# Altium schematic sheet 22-TimingConnections.SchDoc
size B; SheetNumber: 22; SheetTotal: 25; SPICEModelCacheZJVVAHZB: <root> / <DocumentId>ZJVVAHZB</DocumentId> / <CacheFrame Number="0"> / <Model Name="emk105bj105_v-f" Kind="CKT"> / <Text>* EMK105BJ105_V-F     SPICE MODEL  ( General Type ) / *-------------------------------------------------------------------------------------------------------- / * Model Generated by TAIYO YUDEN Corporation (http://www.ty-top.com) / * Version 1.0 / * TAIYO YUDEN Control No. 170508_130520 / * Copyright(c) 2012 TAIYO YUDEN CO.,LTD. All Rights Reserved. / *-------------------------------------------------------------------------------------------------------- / * / * Products Name : Multilayer Ceramic Capacitors / * / * Characteristics : / *     Capacitance : 1 uF , Rated Voltage : 16V , TCC : X5R / *     Case Size : 1.0 x 0.5 / 0.039 x 0.02 [mm/inch] , Thickness : 0.5 / 0.02 [mm/inch] / *     (Conditions: Temperature = 25 degC , DC Bias Current/Voltage = 0A / 0V) / * / * Frequency Range : 40Hz - 3GHz / * / * External Node Assignments : / * / *  1  o---| |---o  2 / * / *-------------------------------------------------------------------------------------------------------- / .SubCkt EMK105BJ105_V-F 1 2 / **************************** / C0 1 110 0.68309u / Cm 1 101 0.26053u / C1 101 102 0.94076u / Rc1 101 102 1.9029k / C2 102 103 0.66707u / Rc2 102 103 120.36 / C3 103 110 0.57203u / Rc3 103 110 2.1097 / C2m 1 301 0.1871u / C21 301 302 3.2494u / Rc21 301 302 1.1117k / C22 302 303 2.1014u / Rc22 302 303 1.484k / C23 303 304 2.1172u / Rc23 303 304 1.3876k / C24 304 305 0.75729u / Rc24 304 305 332.59 / C25 305 306 0.94401u / Rc25 305 306 249.09 / C26 306 307 0.34674u / Rc26 306 307 28.352 / C27 307 308 0.37158u / Rc27 307 308 19.989 / C28 308 309 0.17933u / Rc28 308 309 31.748 / C29 309 110 0.016445u / Rc29 309 110 1.0592 / Rp0 1 110 100Meg / L0 110 120 0.2216n / Lm 120 130 0.1509n / L1 120 121 0.12659n / RL1 121 130 0.85161 / L2 120 122 0.15996n / RL2 122 130 0.42469 / L3 120 123 7.9543n / RL3 123 130 0.54643m / CR 120 124 0.24334u / LR 124 125 0.090738n / RR 125 130 68.076m / CL 130 140 2.7354p / LL 130 140 0.10762n / RL 130 140 50.614 / Rs 140 2 7.5416m / **************************** / .ends EMK105BJ105_V-F</Text> / </Model> / </CacheFrame> / </root>
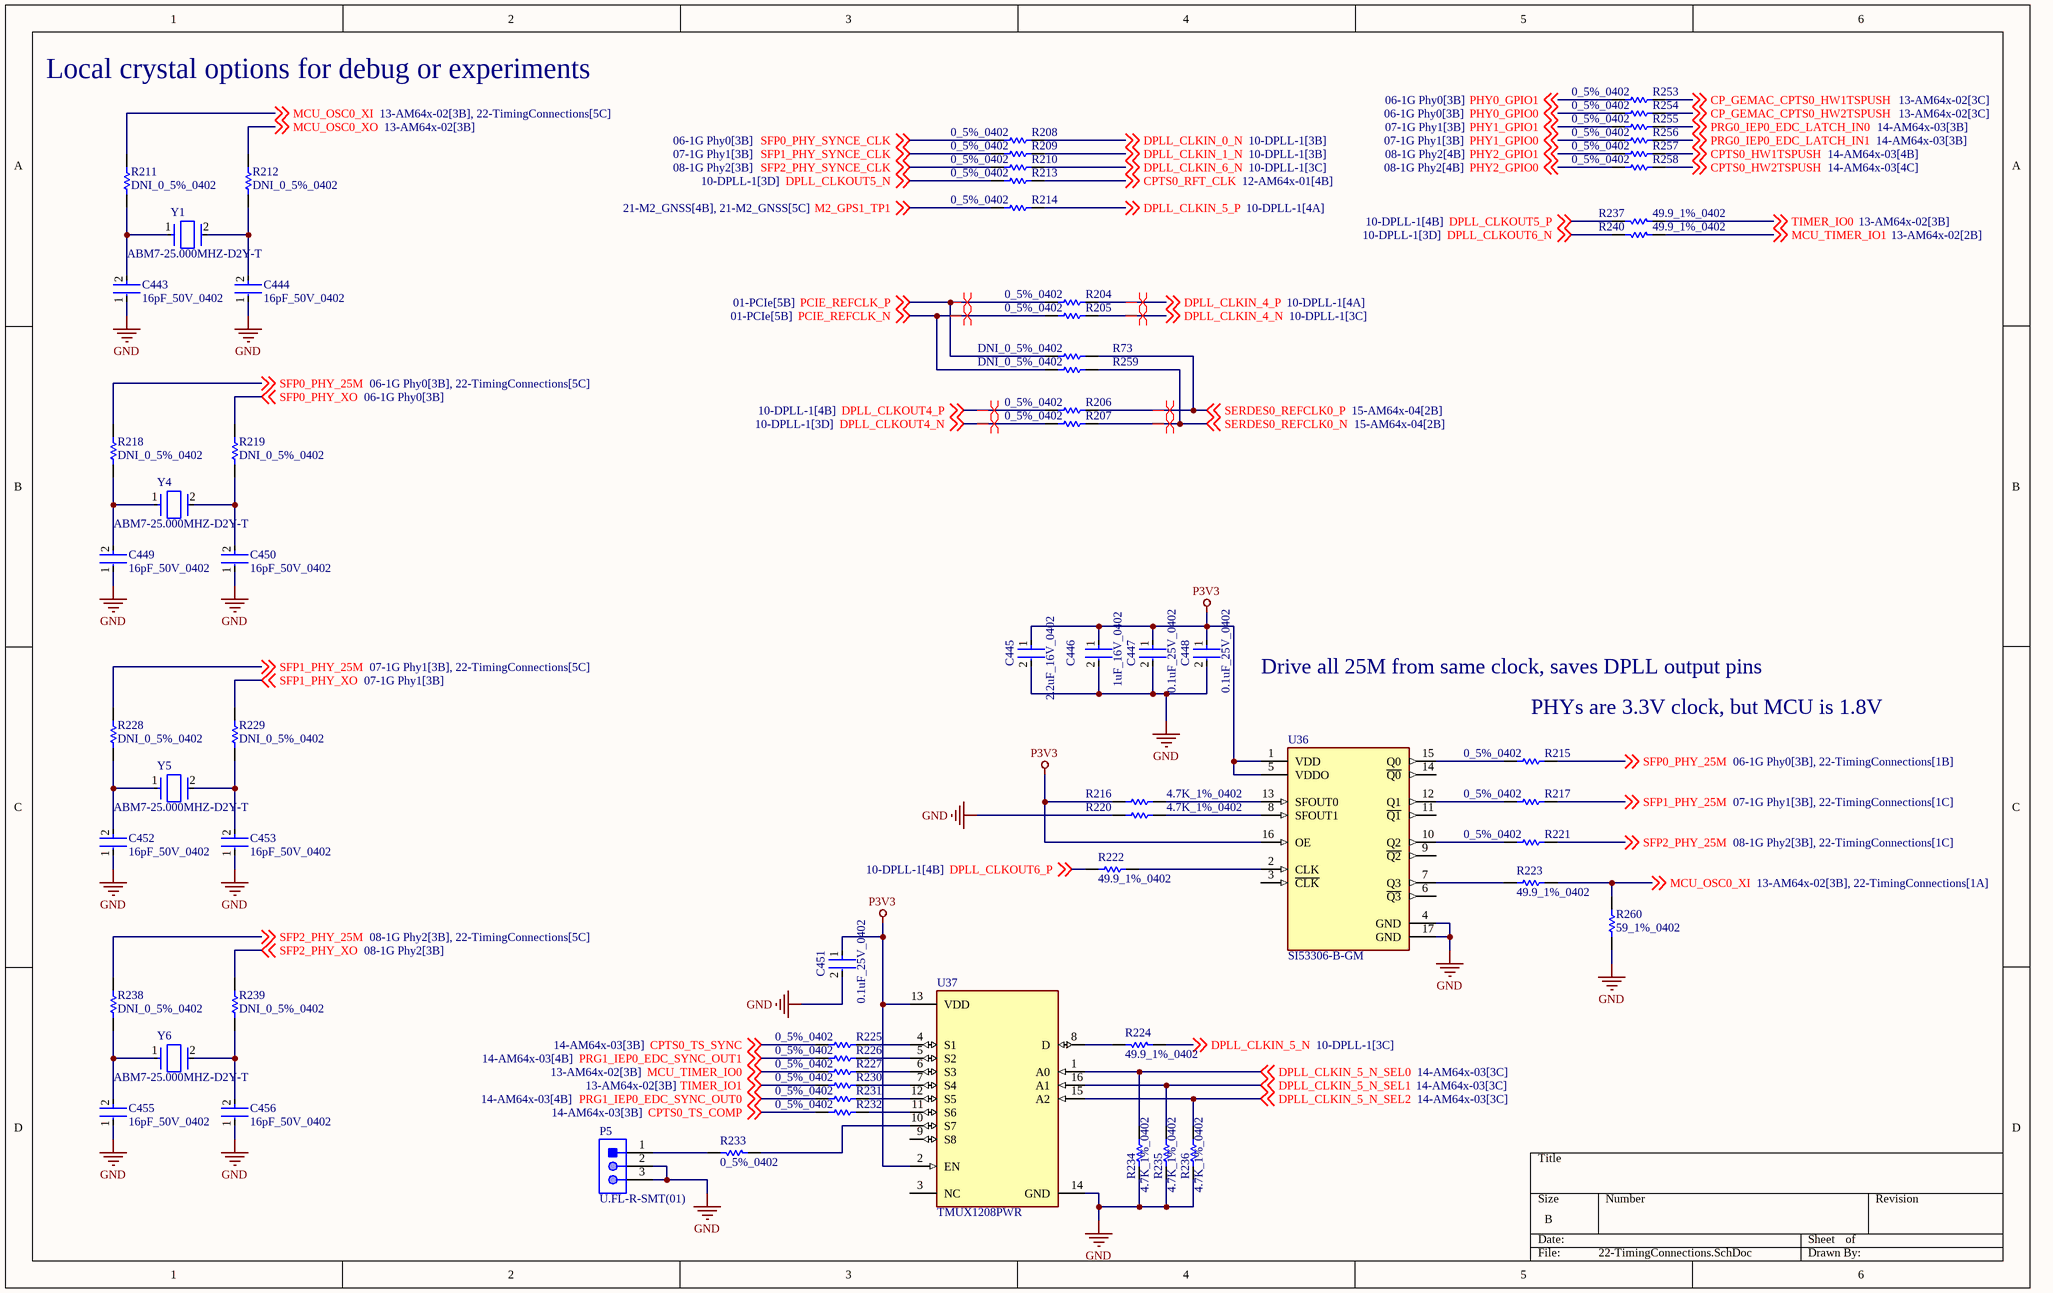
[diagram p0: 22-TimingConnections.SchDoc]

## Parts
C443  16pF_50V_0402  [FP-CBR04C-MFG]
C444  16pF_50V_0402  [FP-CBR04C-MFG]
C445  2.2uF_16V_0402  [FP-C1005-050-0_05-IPC_A]
C446  1uF_16V_0402  [FP-0402-L_1_0_0_05-W_0_5-IPC_A]
C447  0.1uF_25V_0402  [FP-0402-L_1_0_1-W_0_5_0_1-IPC_C]
C448  0.1uF_25V_0402  [FP-0402-L_1_0_1-W_0_5_0_1-IPC_C]
C449  16pF_50V_0402  [FP-CBR04C-MFG]
C450  16pF_50V_0402  [FP-CBR04C-MFG]
C451  0.1uF_25V_0402  [FP-0402-L_1_0_1-W_0_5_0_1-IPC_C]
C452  16pF_50V_0402  [FP-CBR04C-MFG]
C453  16pF_50V_0402  [FP-CBR04C-MFG]
C455  16pF_50V_0402  [FP-CBR04C-MFG]
C456  16pF_50V_0402  [FP-CBR04C-MFG]
P5  U.FL-R-SMT(01)  [HRS-U.FL-R-SMT(10)_V]
R73  DNI_0_5%_0402  [RESC1005X40X25LL10T10]  (no BOM)
R204  0_5%_0402  [RESC1005X40X25LL10T10]
R205  0_5%_0402  [RESC1005X40X25LL10T10]
R206  0_5%_0402  [RESC1005X40X25LL10T10]
R207  0_5%_0402  [RESC1005X40X25LL10T10]
R208  0_5%_0402  [RESC1005X40X25LL10T10]
R209  0_5%_0402  [RESC1005X40X25LL10T10]
R210  0_5%_0402  [RESC1005X40X25LL10T10]
R211  DNI_0_5%_0402  [RESC1005X40X25LL10T10]  (no BOM)
R212  DNI_0_5%_0402  [RESC1005X40X25LL10T10]  (no BOM)
R213  0_5%_0402  [RESC1005X40X25LL10T10]
R214  0_5%_0402  [RESC1005X40X25LL10T10]
R215  0_5%_0402  [RESC1005X40X25LL10T10]
R216  4.7K_1%_0402  [RESC1005X40X25NL10T10]
R217  0_5%_0402  [RESC1005X40X25LL10T10]
R218  DNI_0_5%_0402  [RESC1005X40X25LL10T10]  (no BOM)
R219  DNI_0_5%_0402  [RESC1005X40X25LL10T10]  (no BOM)
R220  4.7K_1%_0402  [RESC1005X40X25NL10T10]
R221  0_5%_0402  [RESC1005X40X25LL10T10]
R222  49.9_1%_0402  [RESC1005X40X25NL10T10]
R223  49.9_1%_0402  [RESC1005X40X25NL10T10]
R224  49.9_1%_0402  [RESC1005X40X25NL10T10]
R225  0_5%_0402  [RESC1005X40X25LL10T10]
R226  0_5%_0402  [RESC1005X40X25LL10T10]
R227  0_5%_0402  [RESC1005X40X25LL10T10]
R228  DNI_0_5%_0402  [RESC1005X40X25LL10T10]  (no BOM)
R229  DNI_0_5%_0402  [RESC1005X40X25LL10T10]  (no BOM)
R230  0_5%_0402  [RESC1005X40X25LL10T10]
R231  0_5%_0402  [RESC1005X40X25LL10T10]
R232  0_5%_0402  [RESC1005X40X25LL10T10]
R233  0_5%_0402  [RESC1005X40X25LL10T10]
R234  4.7K_1%_0402  [RESC1005X40X25NL10T10]
R235  4.7K_1%_0402  [RESC1005X40X25NL10T10]
R236  4.7K_1%_0402  [RESC1005X40X25NL10T10]
R237  49.9_1%_0402  [RESC1005X40X25NL10T10]
R238  DNI_0_5%_0402  [RESC1005X40X25LL10T10]  (no BOM)
R239  DNI_0_5%_0402  [RESC1005X40X25LL10T10]  (no BOM)
R240  49.9_1%_0402  [RESC1005X40X25NL10T10]
R253  0_5%_0402  [RESC1005X40X25LL10T10]
R254  0_5%_0402  [RESC1005X40X25LL10T10]
R255  0_5%_0402  [RESC1005X40X25LL10T10]
R256  0_5%_0402  [RESC1005X40X25LL10T10]
R257  0_5%_0402  [RESC1005X40X25LL10T10]
R258  0_5%_0402  [RESC1005X40X25LL10T10]
R259  DNI_0_5%_0402  [RESC1005X40X25LL10T10]  (no BOM)
R260  59_1%_0402  [RESC1005X40X25ML10T10]
U36  SI53306-B-GM  [FP-SI53306-B-GM-MFG]
U37  TMUX1208PWR  [FP-PW0016A-IPC_A]
Y1  ABM7-25.000MHZ-D2Y-T  [FP-ABM7-MFG]
Y4  ABM7-25.000MHZ-D2Y-T  [FP-ABM7-MFG]
Y5  ABM7-25.000MHZ-D2Y-T  [FP-ABM7-MFG]
Y6  ABM7-25.000MHZ-D2Y-T  [FP-ABM7-MFG]

## Nets
GND: C443.1 C444.1 C445.2 C446.2 C447.2 C448.2 C449.1 C450.1 C451.2 C452.1 C453.1 C455.1 C456.1 P5.2 P5.3 R220.2 R234.2 R235.2 R236.2 R260.1 U36.4(GND) U36.17(GND) U37.14(GND)
P3V3: C445.1 C446.1 C447.1 C448.1 C451.1 R216.2 U36.1(VDD) U36.5(VDDO) U36.16(OE) U37.2(EN) U37.13(VDD)
CP_GEMAC_CPTS0_HW1TSPUSH: R253.2 ; off-sheet CP_GEMAC_CPTS0_HW1TSPUSH
CP_GEMAC_CPTS0_HW2TSPUSH: R254.2 ; off-sheet CP_GEMAC_CPTS0_HW2TSPUSH
CPTS0_HW1TSPUSH: R257.2 ; off-sheet CPTS0_HW1TSPUSH
CPTS0_HW2TSPUSH: R258.2 ; off-sheet CPTS0_HW2TSPUSH
CPTS0_RFT_CLK: R213.2 ; off-sheet CPTS0_RFT_CLK
CPTS0_TS_COMP: R232.1 ; off-sheet CPTS0_TS_COMP
CPTS0_TS_SYNC: R225.1 ; off-sheet CPTS0_TS_SYNC
DPLL_CLKIN_0_N: R208.2 ; off-sheet DPLL_CLKIN_0_N
DPLL_CLKIN_1_N: R209.2 ; off-sheet DPLL_CLKIN_1_N
DPLL_CLKIN_4_N: R205.2 ; off-sheet DPLL_CLKIN_4_N
DPLL_CLKIN_4_P: R204.2 ; off-sheet DPLL_CLKIN_4_P
DPLL_CLKIN_5_N: R224.1 ; off-sheet DPLL_CLKIN_5_N
DPLL_CLKIN_5_N_SEL0: R234.1 U37.1(A0) ; off-sheet DPLL_CLKIN_5_N_SEL0
DPLL_CLKIN_5_N_SEL1: R235.1 U37.16(A1) ; off-sheet DPLL_CLKIN_5_N_SEL1
DPLL_CLKIN_5_N_SEL2: R236.1 U37.15(A2) ; off-sheet DPLL_CLKIN_5_N_SEL2
DPLL_CLKIN_5_P: R214.2 ; off-sheet DPLL_CLKIN_5_P
DPLL_CLKIN_6_N: R210.2 ; off-sheet DPLL_CLKIN_6_N
DPLL_CLKOUT4_N: R207.1 ; off-sheet DPLL_CLKOUT4_N
DPLL_CLKOUT4_P: R206.1 ; off-sheet DPLL_CLKOUT4_P
DPLL_CLKOUT5_N: R213.1 ; off-sheet DPLL_CLKOUT5_N
DPLL_CLKOUT5_P: R237.2 ; off-sheet DPLL_CLKOUT5_P
DPLL_CLKOUT6_N: R240.2 ; off-sheet DPLL_CLKOUT6_N
DPLL_CLKOUT6_P: R222.1 ; off-sheet DPLL_CLKOUT6_P
M2_GPS1_TP1: R214.1 ; off-sheet M2_GPS1_TP1
MCU_OSC0_XI: R211.2 R223.2 R260.2 ; off-sheet MCU_OSC0_XI
MCU_OSC0_XO: R212.2 ; off-sheet MCU_OSC0_XO
MCU_TIMER_IO0: R227.1 ; off-sheet MCU_TIMER_IO0
MCU_TIMER_IO1: R240.1 ; off-sheet MCU_TIMER_IO1
PCIE_REFCLK_N: R205.1 R259.1 ; off-sheet PCIE_REFCLK_N
PCIE_REFCLK_P: R73.1 R204.1 ; off-sheet PCIE_REFCLK_P
PHY0_GPIO0: R254.1 ; off-sheet PHY0_GPIO0
PHY0_GPIO1: R253.1 ; off-sheet PHY0_GPIO1
PHY1_GPIO0: R256.1 ; off-sheet PHY1_GPIO0
PHY1_GPIO1: R255.1 ; off-sheet PHY1_GPIO1
PHY2_GPIO0: R258.1 ; off-sheet PHY2_GPIO0
PHY2_GPIO1: R257.1 ; off-sheet PHY2_GPIO1
PRG0_IEP0_EDC_LATCH_IN0: R255.2 ; off-sheet PRG0_IEP0_EDC_LATCH_IN0
PRG0_IEP0_EDC_LATCH_IN1: R256.2 ; off-sheet PRG0_IEP0_EDC_LATCH_IN1
PRG1_IEP0_EDC_SYNC_OUT0: R231.1 ; off-sheet PRG1_IEP0_EDC_SYNC_OUT0
PRG1_IEP0_EDC_SYNC_OUT1: R226.1 ; off-sheet PRG1_IEP0_EDC_SYNC_OUT1
SERDES0_REFCLK0_N: R207.2 R259.2 ; off-sheet SERDES0_REFCLK0_N
SERDES0_REFCLK0_P: R73.2 R206.2 ; off-sheet SERDES0_REFCLK0_P
SFP0_PHY_25M: R215.2 R218.2 ; off-sheet SFP0_PHY_25M
SFP0_PHY_SYNCE_CLK: R208.1 ; off-sheet SFP0_PHY_SYNCE_CLK
SFP0_PHY_XO: R219.2 ; off-sheet SFP0_PHY_XO
SFP1_PHY_25M: R217.2 R228.2 ; off-sheet SFP1_PHY_25M
SFP1_PHY_SYNCE_CLK: R209.1 ; off-sheet SFP1_PHY_SYNCE_CLK
SFP1_PHY_XO: R229.2 ; off-sheet SFP1_PHY_XO
SFP2_PHY_25M: R221.2 R238.2 ; off-sheet SFP2_PHY_25M
SFP2_PHY_SYNCE_CLK: R210.1 ; off-sheet SFP2_PHY_SYNCE_CLK
SFP2_PHY_XO: R239.2 ; off-sheet SFP2_PHY_XO
TIMER_IO0: R237.1 ; off-sheet TIMER_IO0
TIMER_IO1: R230.1 ; off-sheet TIMER_IO1
NetC443_2: C443.2 R211.1 Y1.1
NetC444_2: C444.2 R212.1 Y1.2
NetC449_2: C449.2 R218.1 Y4.1
NetC450_2: C450.2 R219.1 Y4.2
NetC452_2: C452.2 R228.1 Y5.1
NetC453_2: C453.2 R229.1 Y5.2
NetC455_2: C455.2 R238.1 Y6.1
NetC456_2: C456.2 R239.1 Y6.2
NetP5_1: P5.1 R233.2
NetR215_1: R215.1 U36.15(Q0)
NetR216_1: R216.1 U36.13(SFOUT0)
NetR217_1: R217.1 U36.12(Q1)
NetR220_1: R220.1 U36.8(SFOUT1)
NetR221_1: R221.1 U36.10(Q2)
NetR222_2: R222.2 U36.2(CLK)
NetR223_1: R223.1 U36.7(Q3)
NetR224_2: R224.2 U37.8(D)
NetR225_2: R225.2 U37.4(S1)
NetR226_2: R226.2 U37.5(S2)
NetR227_2: R227.2 U37.6(S3)
NetR230_2: R230.2 U37.7(S4)
NetR231_2: R231.2 U37.12(S5)
NetR232_2: R232.2 U37.11(S6)
NetR233_1: R233.1 U37.10(S7)

Not connected (* = marked no-connect by the designer): U36 3(~{CLK}) 6(~{Q3}) 9(~{Q2}) 11(~{Q1}) 14(~{Q0}); U37 3(NC) 9(S8)

## Layout directives
differential pair: DPLL_CLKIN_4_N, DPLL_CLKIN_4_P, DPLL_CLKOUT4_N, DPLL_CLKOUT4_P, PCIE_REFCLK_N, PCIE_REFCLK_P, SERDES0_REFCLK0_N, SERDES0_REFCLK0_P

## Notes on the sheet
- Local crystal options for debug or experiments
- Drive all 25M from same clock, saves DPLL output pins
- (near R215) PHYs are 3.3V clock, but MCU is 1.8V

## Library data of the parts
C443 C444 C449 C450 C452 C453 C455 C456 = CMP-2008-00007-2: CAP CER 16PF 50V C0G/NP0 0402; Manufacturer: KEMET; Manufacturer Part Number: CBR04C160J5GAC; Material: Ceramic; Temperature Characteristic: C0G; Temperature Coefficient: 30ppm/°C; Tolerance: 0.05; Device Class L1: Passive Components; Temperature Range Low: -55°C; Device Class L3: Ceramic Capacitors; Digikey Description: CAP CER 16PF 50V C0G/NP0 0402; ComponentLink2Description: Datasheet; Capacitance: 16 pF; Mouser Description: Multilayer Ceramic Capacitors MLCC - SMD/SMT 50volts 16pF C0G 0402 5% Tol RF; ComponentLink2URL: https://content.kemet.com/datasheets/KEM_C1030_CBR_SMD.pdf; RoHS: TRUE; Ipc Land Pattern Name: CAPC10050X50; Package: CBR04C; Height: 0.55mm; Octopart: https://octopart.com/cbr04c160j5gac-kemet-20446740; Temperature Range High: +125°C; Temperature: -55°C to +125°C; Lead Free: Yes; Value: 16 pF; Voltage Rating: 50 V; Category: Cap; Automotive: No; Device Class L2: Capacitors
C445 = CMP-2000-05998-2: Multilayer Ceramic Capacitors 2.2μF ±10% 16V X5R SMD 0402; Capacitance: 2.2uF; REACH SVHC: No SVHC; Series: C; Termination: SMD/SMT; Case Code (Imperial): 0402; Depth: 0.5mm; Mount: Surface Mount; Width: 0.02inch; Package Quantity: 1; Dielectric Material: Ceramic; Length: 1mm; Packaging: Tape and Reel; Case Code (Metric): 1005; RoHS Compliant: Yes; Dielectric: X5R; Max Operating Temperature: 85°C; Lead Free: Lead Free; Weight: 2.3E-05oz; Thickness: 0.022inch; Voltage Rating (DC): 16V; Tolerance: 10%; Voltage Rating: 16V; Resistor Type: Ceramic; Height: 0.5mm; Case/Package: 0402; Min Operating Temperature: -55°C
C446 = CMP-14477-000104-2: None; Tolerance: 10%; Voltage Rating: 16V; Dielectric: X5R; Capacitance: 1uF; Packaging: Tape and Reel; Depth: 0.5mm; Mount: Surface Mount; Thickness: 0.022inch; Package Quantity: 1; Min Operating Temperature: -55°C; Series: M; Voltage Rating (DC): 16V; Termination: SMD/SMT; Case/Package: 0402; Number of Pins: 2; Case Code (Imperial): 0402; Length: 1mm; Halogen Free: Halogen Free; Case Code (Metric): 1005; Width: 0.02inch; RoHS Compliant: Yes; Radiation Hardening: No; Max Operating Temperature: 85°C; Height: 0.5mm; Construction: Flat
C447 C448 C451 = CMP-2008-02519-2: General Purpose Ceramic Capacitor, 0402, 100nF, 10%, X7R, 15%, 25V; Package Quantity: 1; Capacitance: 100nF; Min Operating Temperature: -55°C; Voltage: 25V; Voltage Rating: 25V; Construction: Flat; Max Operating Temperature: 125°C; Radiation Hardening: No; Depth: 0.5mm; Thickness: 0.022inch; Voltage Rating (DC): 25V; Number of Pins: 2; Lead Free: Lead Free; Series: -; REACH SVHC: No SVHC; Length: 1mm; Dielectric: X7R; RoHS Compliant: Yes; Mount: Surface Mount; Packaging: Tape and Reel; Case/Package: 0402; Case Code (Imperial): 0402; Termination: SMD/SMT; Width: 0.02inch; Case Code (Metric): 1005; Tolerance: 10%
P5 = CMP-2000-05151-1: CONN RECPT ULTRA-MINI COAX SMD; Manufacturer: Hirose Electric; Centre Contact Resistance: 25mohm; Voltage Rating V AC: 60V; Female Contact Material: PhosphorBronze; Contact Resistance: 10mohm; Male Contact Material: Brass; Connector Type: UFLCoaxial; Connector Mounting: PCB; Impedance: 50ohm; Insulation Resistance: 500Mohm; Secondary Insulation Material: PBT; Frequency Max: 6GHz; Body Plating: Silver; External Length / Height: 2.5mm; Approval Category: UL94V-0; Female Contact Plating: Gold; Connector Mounting Orientation: PCBoard; VSWR: 1.3; Coaxial Termination: Solder; Body Style: StraightJack; SVHC: NoSVHC(18-Jun-2012); Jacket Material: LCP; Package Reference: U.FL-R-SMT(10); Datasheet Version: Feb-04; Outer Contact Resistance: 10mohm; Contact Plating: Gold; Mounting Type: PCBoard; Flammability Rating: UL94V-0; Operating Frequency Max: 6GHz; Termination Method: Solder; Male Contact Plating: Gold; Package Description: 3-Pin Surface Mount Device, Body 2.6 x 2.6 mm; Operating Temperature Min: -40degC; Manufacturer URL: https://www.hirose.com; Operating Temperature Max: 90degC; Contact Material: PhosphorBronze; Datasheet URL: http://www.farnell.com/datasheets/91524.pdf; Material: PhosphorBronze
R73 R204-R215 R217-R219 R221 R225-R233 R238 R239 R253-R259 = CMP-2002-04569-1: Manufacturer: KOA Speer; Part Number: RK73Z1ETTP
R216 R220 R234-R236 = CMP-2002-05217-1: Manufacturer: Bourns; Part Number: CR0402-FX-4701GLF
R222-R224 R237 R240 = CMP-2002-04448-1: Part Number: RK73H1ETTP49R9F; Manufacturer: KOA Speer
R260 = CMP-2002-04479-1: Manufacturer: KOA Speer; Part Number: RK73H1ETTP59R0F
U36 = CMP-08071-000002-1: IC BUFFER/LEVEL XLATOR 1:4 16QFN; Manufacturer: Silicon Labs; Number Of Elements: 1; Logic Function: Non-Inverting; Standoff Height: 0mm; Propagation Delay: 875ps; Nominal Supply Current: 65mA; Number Of Outputs: 4; Max Supply Voltage: 3.63V; Max Junction Temp: +125°C; Min Supply Voltage: 1.71V; Temperature Range High: +85°C; RoHS: TRUE; Device Class L1: Integrated Circuits (ICs); ComponentLink2URL: https://www.silabs.com/documents/public/data-sheets/si5330x-datasheet.pdf; Mouser Description: Clock Fanout Buffer (Distribution), Translator IC 725MHz 16-VFQFN Exposed Pad; Digikey Description: IC BUFFER/LEVEL XLATOR 1:4 16QFN; Ipc Land Pattern Name: QFN50P300X300X85-16; Package: 0; Octopart: https://octopart.com/si53306-b-gm-silicon+labs-29690230; Automotive: No; Lead Free: Yes; Number Of Inputs: 1; Category: IC; ComponentLink2Description: Datasheet; Height: 0.9mm; Ambient Temperature Range High: +85°C; Temperature: -40°C to +85°C; Ambient Temperature Range Low: -40°C; Temperature Range Low: -40°C; Device Class L2: Clock and Timing; Manufacturer Part Number: SI53306-B-GM; Device Class L3: Clock Buffers
U37 = CMP-04892-000035-1: IC SWITCH SINGLE 16TSSOP; RoHS Compliant: Yes
Y1 Y4-Y6 = CMP-27762-010820-1: Crystal 25MHz ±20ppm 18pF SMD-2 6mm x 3.5mm; Frequency Stability: 30ppm; ESR (Equivalent Series Resistance): 50R; Depth: 3.5mm; Mount: Surface Mount; Termination: SMD/SMT; Packaging: Tape and Reel; Tolerance: 20ppm; REACH SVHC: Yes; Package Quantity: 1000; Resistor Type: Ceramic; Min Operating Temperature: -40°C; Frequency: 25MHz; Load Capacitance: 18pF; Number of Pins: 2; Case/Package: CSMD; Series: ABM7; Lead Free: Lead Free; Max Operating Temperature: 85°C; Radiation Hardening: No; Frequency Tolerance: 20ppm; Height: 0.055inch; Series Resistance: 50R; Length: 6mm; Width: 3.3mm; Operating Frequency: 25 MHz